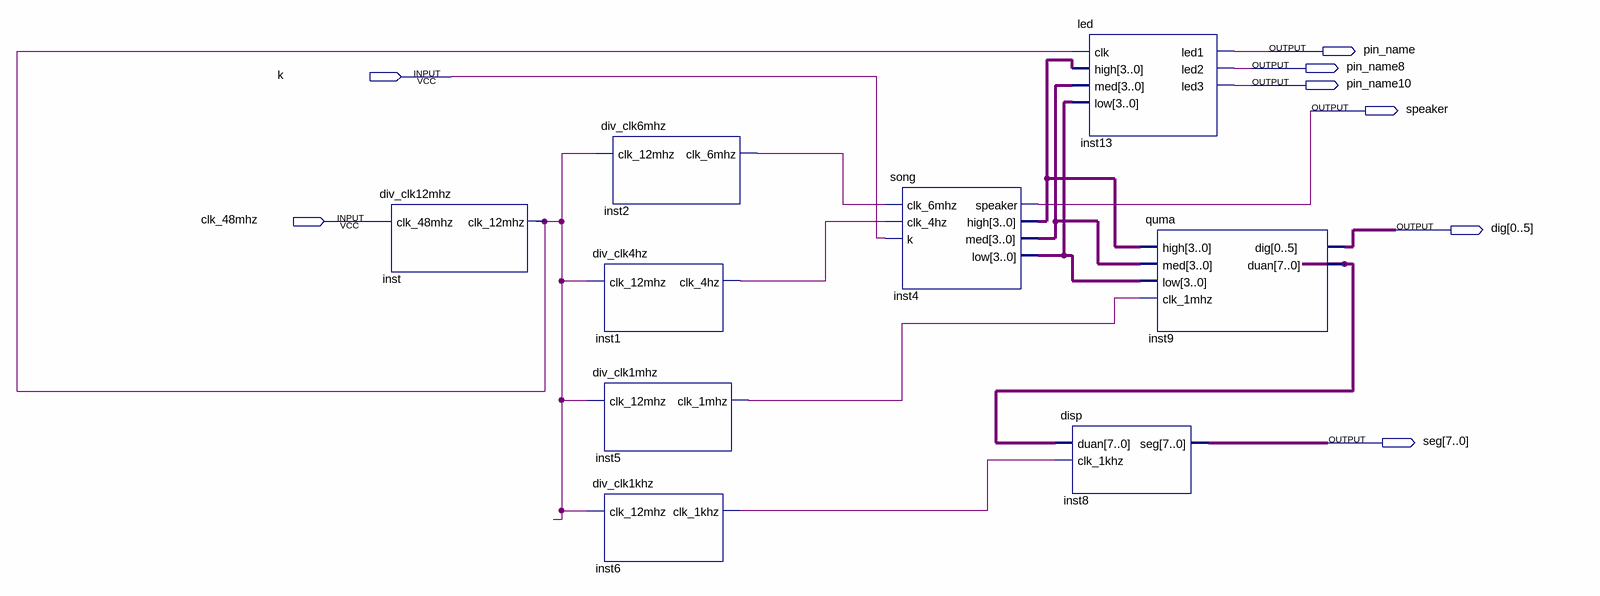
[diagram p0: schematic sheet]
// Quartus schematic yinyue.bdf as structural Verilog: 9 symbols, 8 pins
module yinyue (
  input  k,
  input  clk_48mhz,
  output pin_name,
  output pin_name8,
  output pin_name10,
  output speaker,
  output [0:5] dig,
  output [7:0] seg
);

  wire inst1_clk_4hz, inst2_clk_6mhz, inst5_clk_1mhz, inst6_clk_1khz, inst_clk_12mhz;
  wire [3:0] inst4_high, inst4_low, inst4_med;
  wire [7:0] inst9_duan;

  div_clk12mhz inst (.clk_48mhz(clk_48mhz), .clk_12mhz(inst_clk_12mhz));
  div_clk6mhz inst2 (.clk_12mhz(inst_clk_12mhz), .clk_6mhz(inst2_clk_6mhz));
  div_clk4hz inst1 (.clk_12mhz(inst_clk_12mhz), .clk_4hz(inst1_clk_4hz));
  div_clk1mhz inst5 (.clk_12mhz(inst_clk_12mhz), .clk_1mhz(inst5_clk_1mhz));
  div_clk1khz inst6 (.clk_12mhz(inst_clk_12mhz), .clk_1khz(inst6_clk_1khz));
  song inst4 (
    .clk_6mhz(inst2_clk_6mhz), .clk_4hz(inst1_clk_4hz), .k(k), .speaker(speaker), .high(inst4_high),
    .med(inst4_med), .low(inst4_low));
  led inst13 (
    .clk(inst_clk_12mhz), .high(inst4_high), .med(inst4_med), .low(inst4_low), .led1(pin_name),
    .led2(pin_name8), .led3(pin_name10));
  disp inst8 (.duan(inst9_duan), .clk_1khz(inst6_clk_1khz), .seg(seg));
  quma inst9 (
    .high(inst4_high), .med(inst4_med), .low(inst4_low), .clk_1mhz(inst5_clk_1mhz), .dig(dig),
    .duan(inst9_duan));
endmodule
